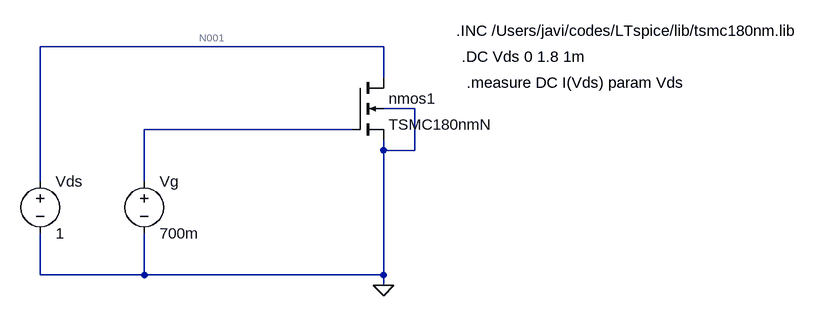
[diagram p0: schematic Draft2.asc]
Draft2.asc, the LTspice schematic file:
Version 4
SHEET 1 1088 680
WIRE 432 80 -96 80
WIRE 432 128 432 80
WIRE 480 176 432 176
WIRE 384 208 64 208
WIRE 432 240 432 224
WIRE 480 240 480 176
WIRE 480 240 432 240
WIRE -96 288 -96 80
WIRE 64 288 64 208
WIRE -96 432 -96 368
WIRE 64 432 64 368
WIRE 64 432 -96 432
WIRE 432 432 432 240
WIRE 432 432 64 432
WIRE 432 448 432 432
FLAG 432 448 0
SYMBOL nmos4 384 128 R0
SYMATTR InstName nmos1
SYMATTR Value TSMC180nmN
SYMATTR Value2 l=0.18um w=1um
SYMBOL voltage 64 272 R0
SYMATTR InstName Vg
SYMATTR Value 700m
SYMBOL voltage -96 272 R0
SYMATTR InstName Vds
SYMATTR Value 1
TEXT 544 56 Left 2 !.INC /Users/javi/codes/LTspice/lib/tsmc180nm.lib
TEXT 552 96 Left 2 !.DC Vds 0 1.8 1m
TEXT 560 136 Left 2 !.measure DC I(Vds) param Vds

The netlist it stands for:
* Draft2.asc
M§nmos1 N001 N002 0 0 TSMC180nmN l=0.18um w=1um
Vg N002 0 700m
Vds N001 0 1
.model NMOS NMOS
.model PMOS PMOS
.lib standard.mos
.INC /Users/javi/codes/LTspice/lib/tsmc180nm.lib
.DC Vds 0 1.8 1m
.measure DC I(Vds) param Vds
.backanno
.end

* Results of the author's LTspice run, read from the files saved beside the schematic
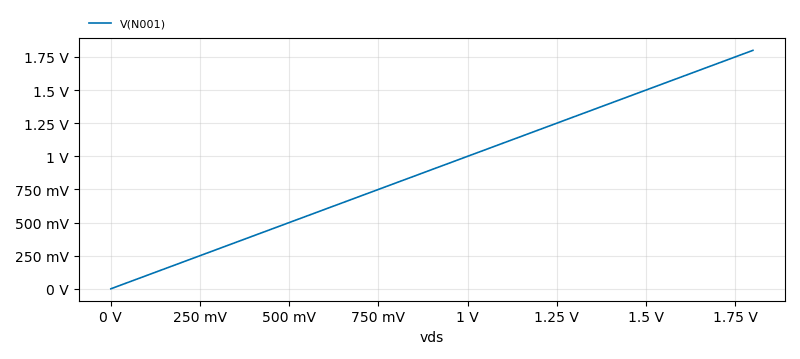
[diagram p1: DC transfer characteristic of Draft2.asc, plotted from the saved traces]
* DC transfer characteristic, 1 run:
*   V(N001): 0 V at vds=0 V, 1.8 V at vds=1.8 V, min 0 V, max 1.8 V
* From the log:
*   i(vds): vds=1.8